# Altium schematic sheet DAPLink.SchDoc
size A4
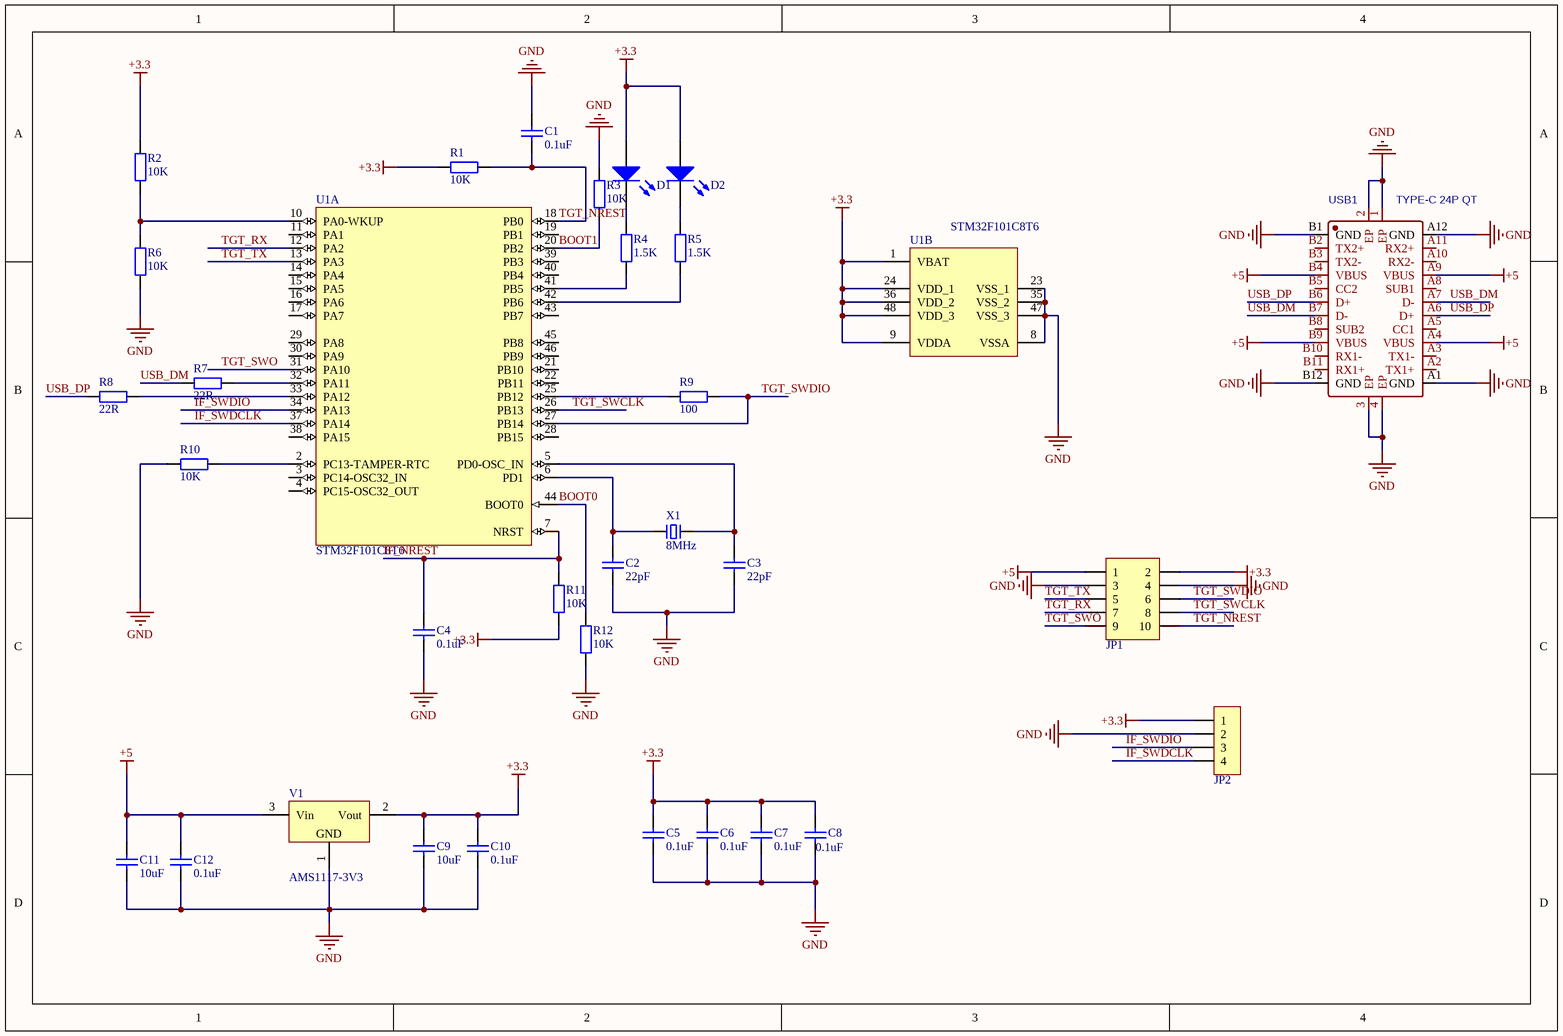
[diagram p0: DAPLink.SchDoc]

## Parts
C1  0.1uF  [C0603_L]
C2  22pF  [C0603_L]
C3  22pF  [C0603_L]
C4  0.1uF  [C0603_L]
C5  0.1uF  [C0603_L]
C6  0.1uF  [C0603_L]
C7  0.1uF  [C0603_L]
C8  0.1uF  [C0603_L]
C9  10uF  [C0603_L]
C10  0.1uF  [C0603_L]
C11  10uF  [C0603_L]
C12  0.1uF  [C0603_L]
D1  LED  [LED0603_B]  (value not drawn)
D2  LED  [LED0603_G]  (value not drawn)
JP1  Header 5X2  [HDR2.54-WI-2x5P]  (value not drawn)
JP2  HDR-1X4  [HDR1.27-LI-4P]  (value not drawn)
R1  10K  [R0603_L]
R2  10K  [R0603_L]
R3  10K  [R0603_L]
R4  1.5K  [R0603_L]
R5  1.5K  [R0603_L]
R6  10K  [R0603_L]
R7  22R  [R0603_L]
R8  22R  [R0603_L]
R9  100  [R0603_L]
R10  10K  [R0603_L]
R11  10K  [R0603_L]
R12  10K  [R0603_L]
U1  STM32F101C8T6  [LQFP48_N]  (parts A,B of 2)
USB1  TYPE-C 24P QT  [USB-C-SMD_TYPE-C-24P-QT]
V1  AMS1117-3V3  [SOT-223]
X1  8MHz  [OSC 5032-2P]

## Nets
+3.3: C5.2 C6.2 C7.2 C8.2 C9.2 C10.2 D1.1(A) D2.1(A) JP1.2 JP2.1 R1.1 R2.1 R11.2 U1.1(VBAT) U1.9(VDDA) U1.24(VDD_1) U1.36(VDD_2) U1.48(VDD_3) V1.2(Vout)
+5: C11.2 C12.2 JP1.1 USB1.A4(VBUS) USB1.A9(VBUS) USB1.B4(VBUS) USB1.B9(VBUS) V1.3(Vin)
GND: C1.2 C2.1 C3.1 C4.1 C5.1 C6.1 C7.1 C8.1 C9.1 C10.1 C11.1 C12.1 JP1.3 JP1.4 JP2.2 R3.1 R6.2 R10.2 R12.2 U1.8(VSSA) U1.23(VSS_1) U1.35(VSS_2) U1.47(VSS_3) USB1.1(EP) USB1.2(EP) USB1.3(EP) USB1.4(EP) USB1.A1(GND) USB1.A12(GND) USB1.B1(GND) USB1.B12(GND) V1.1(GND)
BOOT0: R12.1 U1.44(BOOT0)
BOOT1: R3.2 U1.20(PB2)
IF_NREST: C4.2 R11.1 U1.7(NRST)
IF_SWDCLK: JP2.4 U1.37(PA14)
IF_SWDIO: JP2.3 U1.34(PA13)
TGT_NREST: C1.1 JP1.10 R1.2 U1.18(PB0)
TGT_RX: JP1.7 U1.12(PA2)
TGT_SWCLK: JP1.8 U1.26(PB13)
TGT_SWDIO: JP1.6 R9.1 U1.27(PB14)
TGT_SWO: JP1.9 U1.31(PA10)
TGT_TX: JP1.5 U1.13(PA3)
USB_DM: R7.2 USB1.A7(D-) USB1.B7(D-)
USB_DP: R8.1 USB1.A6(D+) USB1.B6(D+)
NetC2_2: C2.2 U1.6(PD1) X1.2
NetC3_2: C3.2 U1.5(PD0-OSC_IN) X1.1
NetD1_2: D1.2(K) R4.2
NetD2_2: D2.2(K) R5.2
NetR2_2: R2.2 R6.1 U1.10(PA0-WKUP)
NetR4_1: R4.1 U1.41(PB5)
NetR5_1: R5.1 U1.42(PB6)
NetR7_1: R7.1 U1.32(PA11)
NetR8_2: R8.2 U1.33(PA12)
NetR9_2: R9.2 U1.25(PB12)
NetR10_1: R10.1 U1.2(PC13-TAMPER-RTC)

Not connected (* = marked no-connect by the designer): U1 3(PC14-OSC32_IN) 4(PC15-OSC32_OUT) 11(PA1) 14(PA4) 15(PA5) 16(PA6) 17(PA7) 19(PB1) 21(PB10) 22(PB11) 28(PB15) 29(PA8) 30(PA9) 38(PA15) 39(PB3) 40(PB4) 43(PB7) 45(PB8) 46(PB9); USB1 A2(TX1+) A3(TX1-) A5(CC1) A8(SUB1) A10(RX2-) A11(RX2+) B2(TX2+) B3(TX2-) B5(CC2) B8(SUB2) B10(RX1-) B11(RX1+)

## Library data of the parts
C1-C12 = C: 贴片电容; BOM名称: 无极性贴片电容; 联系卖家，免费查找封装: 唯一出售店铺网址https://shop463601444.taobao.com; 封装库来自淘宝卖家ID：黄晶宝石: 其他店铺购入均为盗版假冒封装库，请立即申请退款
D1 D2 = LED: 发光二极管; 封装库来自淘宝卖家 ID：黄晶宝石: 其他店铺购入均为假冒，请立即申请退款，本店奖励现金5~20元
JP1 = Header 5X2: 5*2P接插件; 封装库来自淘宝卖家 ID：黄晶宝石: 其他店铺购入均为盗版假冒封装库; 联系卖家，免费查找封装: 唯一出售店铺网址https://shop463601444.taobao.com; BOM名称: 5*2P接插件
JP2 = Header 4: 4P接插件; 封装库来自淘宝卖家 ID：黄晶宝石: https://shop463601444.taobao.com; BOM名称: 4P接插件
R1-R12 = R: 贴片电阻; 联系卖家，免费查找封装: 唯一出售店铺网址https://shop463601444.taobao.com; 封装库来自淘宝卖家ID：黄晶宝石: 其他店铺购入均为盗版假冒封装库，请立即申请退款; BOM名称: 贴片电阻
U1 = STM32F101C8T6: STM32 ARM-based 32-bit MCU Access Line with 64 kB Flash, 10 kB Internal RAM, -40 to +85癈 Temperature, 48-pin LQFP, Tray; 联系卖家，免费查找封装: 唯一出售店铺网址https://shop463601444.taobao.com; DatasheetVersion: rev14.0, Apr-2011; PackageVersion: rev13, Apr-2011; PackageReference: LQFP48; PackageDescription: 48-Pin Low-Profile Quad Flat Pack, 7 x 7 mm Body, 0.5 mm Pitch (LQFP48); ComponentLink1Description: Manufacturer URL; ComponentLink1URL: http://www.st.com/; ComponentLink2Description: STM32F101 Datasheet; ComponentLink2URL: http://www.st.com/internet/com/TECHNICAL_RESOURCES/TECHNICAL_LITERATURE/DATASHEET/CD00161561.pdf; ComponentLink3Description: STM32 Family Web Page; ComponentLink3URL: www.st.com/stm32
USB1 = TYPE-C 24P QT: Type-C 接口; BOM_Manufacturer: SHOU HAN(首韩); Contributor: LCSC; BOM_Supplier: LCSC; BOM_Supplier Part: C2681555; BOM_Manufacturer Part: TYPE-C 24P QT; BOM_JLCPCB Part Class: Extended Part; spicePre: U; spiceSymbolName: TYPE-C 24P QT
V1 = AMS1117_SOT89: 三端稳压芯片; BOM名称: 稳压芯片; 封装库来自淘宝卖家 ID：黄晶宝石: 其他店铺购入均为盗版，请立即申请退款，本店现金奖励5~20元; 联系卖家 免费查找封装: 唯一出售店铺网址https://shop463601444.taobao.com
X1 = XTAL-2P: 2脚无源脚晶振; 联系卖家，免费查找封装: 唯一出售店铺网址https://shop463601444.taobao.com; BOM名称: 2脚无源脚晶振